# Altium schematic sheet QSPI.SchDoc: QSPI
size 420 x 297 mm; CompanyName: STMicroelectronics; Organization: Microcontrollers Division; DocumentNumber: 8; SheetNumber: 11; SheetTotal: 19
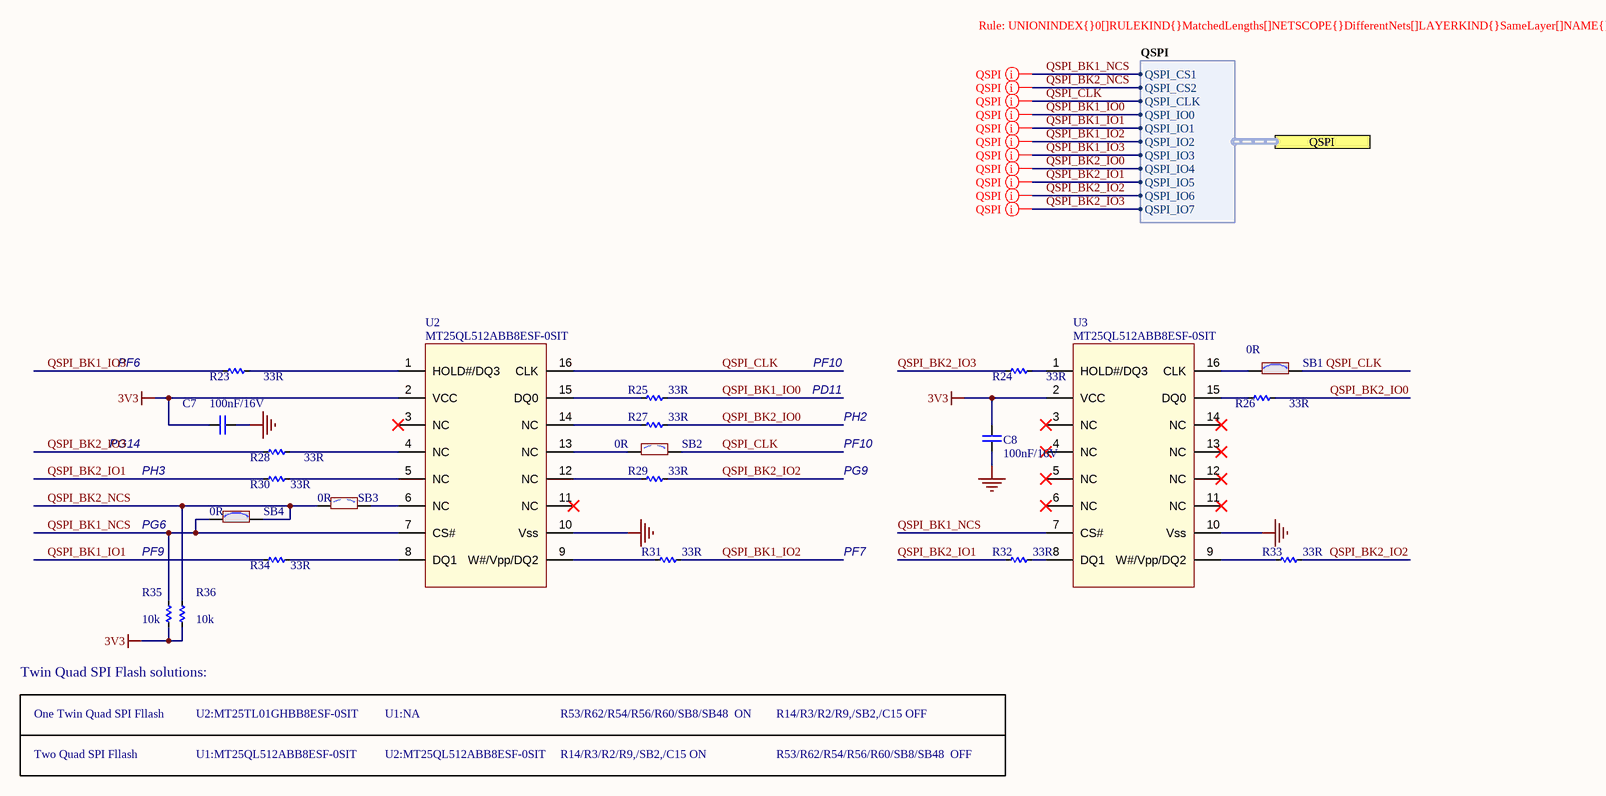
[diagram p0: QSPI.SchDoc]

## Parts
C7  100nF/16V  [CAP_C_1608X80]
C8  100nF/16V  [CAP_C_1608X80]
R23  33R  [RES_C_1608X60]
R24  33R  [RES_C_1608X60]
R25  33R  [RES_C_1608X60]
R26  33R  [RES_C_1608X60]
R27  33R  [RES_C_1608X60]
R28  33R  [RES_C_1608X60]
R29  33R  [RES_C_1608X60]
R30  33R  [RES_C_1608X60]
R31  33R  [RES_C_1608X60]
R32  33R  [RES_C_1608X60]
R33  33R  [RES_C_1608X60]
R34  33R  [RES_C_1608X60]
R35  10k  [RES_C_1608X60]
R36  10k  [RES_C_1608X60]
SB1  value 0R  [Jump2]  (hidden comment: SB_ON)
SB2  value 0R  [Jump2]  (hidden comment: SB_OFF)
SB3  value 0R  [Jump2]  (hidden comment: SB_OFF)
SB4  value 0R  [Jump2]  (hidden comment: SB_ON)
U2  value MT25QL512ABB8ESF-0SIT  [SOP2-16_7P5X10P3_MRN]
U3  value MT25QL512ABB8ESF-0SIT  [SOP2-16_7P5X10P3_MRN]

## Ports
QSPI (harness QSPI)

## Harnesses
QSPI: QSPI_IO1, QSPI_IO0, QSPI_CLK, QSPI_CS1, QSPI_IO2, QSPI_IO3, QSPI_IO5, QSPI_IO4, QSPI_IO6, QSPI_IO7, QSPI_CS2

## Nets
3V3: C7.2 C8.1 R35.1 R36.1 U2.2(VCC) U3.2(VCC)
GND: C7.1 C8.2 U2.10(Vss) U3.10(Vss)
QSPI_BK1_IO0: R25.2 ; port QSPI.QSPI_IO0
QSPI_BK1_IO1: R34.1 ; port QSPI.QSPI_IO1
QSPI_BK1_IO2: R31.2 ; port QSPI.QSPI_IO2
QSPI_BK1_IO3: R23.1 ; port QSPI.QSPI_IO3
QSPI_BK1_NCS: R35.2 SB4.1 U2.7(CS#) U3.7(CS#) ; port QSPI.QSPI_CS1
QSPI_BK2_IO0: R26.2 R27.2 ; port QSPI.QSPI_IO4
QSPI_BK2_IO1: R30.1 R32.1 ; port QSPI.QSPI_IO5
QSPI_BK2_IO2: R29.2 R33.2 ; port QSPI.QSPI_IO6
QSPI_BK2_IO3: R24.1 R28.1 ; port QSPI.QSPI_IO7
QSPI_BK2_NCS: R36.2 SB3.1 SB4.2 ; port QSPI.QSPI_CS2
QSPI_CLK: SB1.2 SB2.2 U2.16(CLK) ; port QSPI.QSPI_CLK
NetR23_2: R23.2 U2.1(HOLD#/DQ3)
NetR24_2: R24.2 U3.1(HOLD#/DQ3)
NetR25_1: R25.1 U2.15(DQ0)
NetR26_1: R26.1 U3.15(DQ0)
NetR27_1: R27.1 U2.14(NC)
NetR28_2: R28.2 U2.4(NC)
NetR29_1: R29.1 U2.12(NC)
NetR30_2: R30.2 U2.5(NC)
NetR31_1: R31.1 U2.9(W#/Vpp/DQ2)
NetR32_2: R32.2 U3.8(DQ1)
NetR33_1: R33.1 U3.9(W#/Vpp/DQ2)
NetR34_2: R34.2 U2.8(DQ1)
NetSB1_1: SB1.1 U3.16(CLK)
NetSB2_1: SB2.1 U2.13(NC)
NetSB3_2: SB3.2 U2.6(NC)

Not connected (* = marked no-connect by the designer): U2 3(NC)* 11(NC)*; U3 3(NC)* 4(NC)* 5(NC)* 6(NC)* 11(NC)* 12(NC)* 13(NC)* 14(NC)*

## Layout directives
rule Matched Net Lengths [Tolerance = 100mil]: QSPI_BK1_IO0, QSPI_BK1_IO1, QSPI_BK1_IO2, QSPI_BK1_IO3, QSPI_BK1_NCS, QSPI_BK2_IO0, QSPI_BK2_IO1, QSPI_BK2_IO2, QSPI_BK2_IO3, QSPI_BK2_NCS, QSPI_CLK

## Notes on the sheet
- PF6
- PF10
- PG14
- PD11
- PH2
- PH3
- PG9
- PF9
- PG6
- PF7
- Twin Quad SPI Flash solutions:
- One Twin Quad SPI Fllash
- U2:MT25TL01GHBB8ESF-0SIT
- U1:NA
- R53/R62/R54/R56/R60/SB8/SB48  ON
- R14/R3/R2/R9,/SB2,/C15 OFF
- Two Quad SPI Fllash
- U1:MT25QL512ABB8ESF-0SIT
- U2:MT25QL512ABB8ESF-0SIT
- R14/R3/R2/R9,/SB2,/C15 ON
- R53/R62/R54/R56/R60/SB8/SB48  OFF
- Sub-system:
- Design by:
- Sheet title:
- Project:
- Sheet:
- of
- Checked by:
- Approved by:
- Doc no:
- Revision:
- Size:
- Date:

## Library data of the parts
C7 C8 = CAP_SMD: CAP_Chip; Value: 33pF
R23-R36 = _RES_B_2: RES
SB1 SB4 = MCD-00071: Solder Bridge ON; Part_Type: Resistor; Manufacturer: YAGEO; Manufacturer_HQ_COO: Unknown; Manufacturer_Part_Number: RC0603JR-070RL; Part_Preference: Recommended; Provided_By: Subcon; Initial_Board_Reference: mb1274; Component_Country_Of_Origin: China; ID: 2521; Order_Code_RS: 199-5647; ShowFields: YES; Internal_Part_Number: MCD-00071; ECCN_US: n/a; ECCN_EU: n/a; Status: Released; ComponentLink1URL: http://tunmcdsvn.tun.st.com/Component_Documentation_Library/Trunk/Resistor/YAGEO_RC_Series; Order_Code_Digikey: 311-0.0GRTR-ND; Order_Code_Farnell: 2421846; Package: 0603
SB2 SB3 = MCD-00072: Solder Bridge OFF; Part_Type: Resistor; Manufacturer: YAGEO; Manufacturer_HQ_COO: Unknown; Manufacturer_Part_Number: RC0603JR-070RL; Part_Preference: Recommended; Initial_Board_Reference: mb1274; Component_Country_Of_Origin: China; ID: 2520; Order_Code_RS: 199-5647; ShowFields: YES; Internal_Part_Number: MCD-00072; Status: Released; ECCN_US: n/a; ECCN_EU: n/a; Provided_By: n/a; ComponentLink1URL: http://tunmcdsvn.tun.st.com/Component_Documentation_Library/Trunk/Resistor/YAGEO_RC_Series; Order_Code_Digikey: 311-0.0GRTR-ND; Order_Code_Farnell: 2421846; Package: 0603
U2 U3 = MCD-01128: Micron Serial NOR Flash Memory; Part_Type: IC; BMS_Part_Number: 9171976; Part_Preference: Recommended; ECCN_US: 3A991.B.1.A; ECCN_EU: NEC; Provided_By: Subcon; Initial_Board_Reference: MB1381; Component_Country_Of_Origin: USA; ID: 3369; ShowFields: YES; Internal_Part_Number: MCD-01128; Status: Released; Manufacturer_Part_Number: MT25QL512ABB8ESF-0SIT; Manufacturer: MICRON; Package: SOIC-16; ComponentLink1Description: Micron_NOR Flash_MT25QL512ABA8ESF-0SIT.pdf; ComponentLink1URL: http://tunmcdsvn.tun.st.com/Component_Documentation_Library/Trunk/IC/MICRON_MT25QL512ABB8ESF-0SIT; Order_Code_Digikey: 557-1651-ND; Order_Code_Farnell: 3549548; Order_Code_RS: N/A